# EasyEDA schematic SCH_555-Circuit_2024-04-25.json
TITLE: Sheet_1; REV: 1.0; Date: 2024-04-22; Sheet: 1/1; Drawn By: brianwes77; Company: Your Company
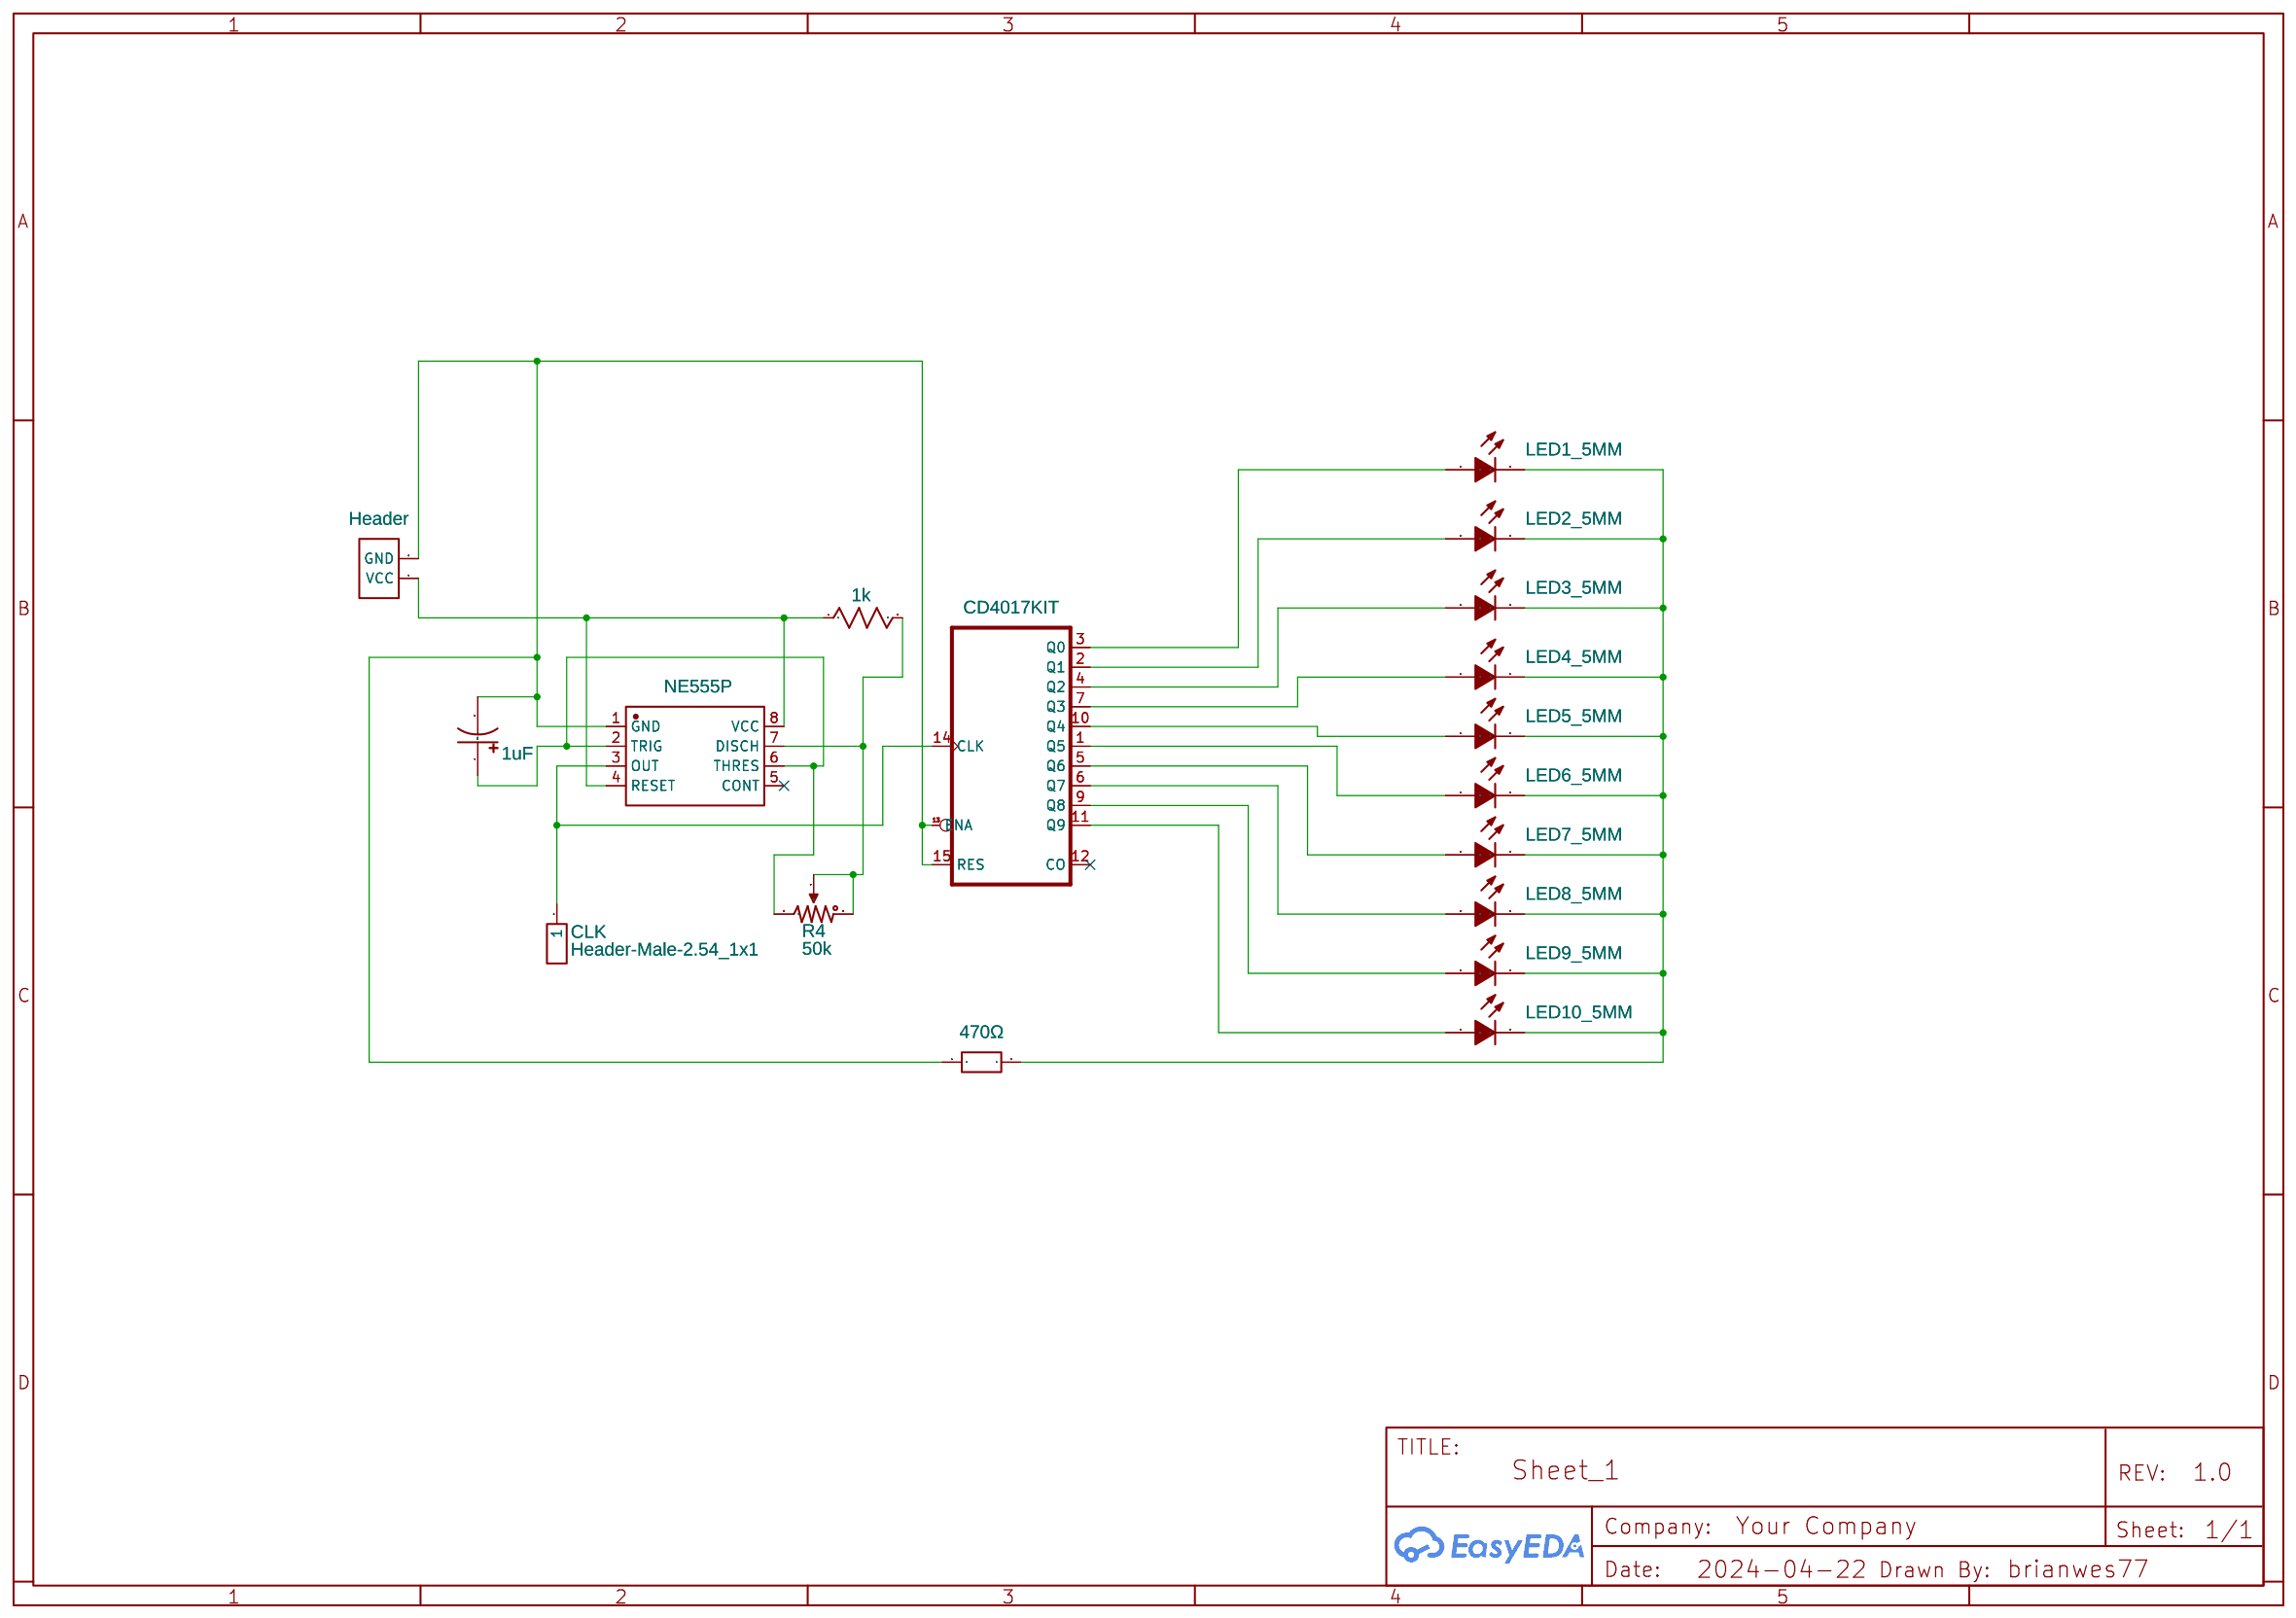
[diagram p0: schematic sheet]

## Parts
C1  1uF  [CAP-TH_BD5.0-P2.00-D0.8-FD]
CLK  Header-Male-2.54_1x1  [HDR-TH_1P-P2.54-V-M]
H1  Header  [HEADER-FEMALE-2.54_1X2]
LED1_5MM  LED_5MM  [LED-TH_BD5.0-P2.54-FD_C9900023552]
LED2_5MM  LED_5MM  [LED-TH_BD5.0-P2.54-FD_C9900023552]
LED3_5MM  LED_5MM  [LED-TH_BD5.0-P2.54-FD_C9900023552]
LED4_5MM  LED_5MM  [LED-TH_BD5.0-P2.54-FD_C9900023552]
LED5_5MM  LED_5MM  [LED-TH_BD5.0-P2.54-FD_C9900023552]
LED6_5MM  LED_5MM  [LED-TH_BD5.0-P2.54-FD_C9900023552]
LED7_5MM  LED_5MM  [LED-TH_BD5.0-P2.54-FD_C9900023552]
LED8_5MM  LED_5MM  [LED-TH_BD5.0-P2.54-FD_C9900023552]
LED9_5MM  LED_5MM  [LED-TH_BD5.0-P2.54-FD_C9900023552]
LED10_5MM  LED_5MM  [LED-TH_BD5.0-P2.54-FD_C9900023552]
R2  1k  [AXIAL-0.3]
R4  50k  [RES-ADJ_3296X]
U1  CD4017KIT  [DIL16-KIT]  (section 1)
U2  NE555P  [DIP-8_L9.8-W6.6-P2.54-LS7.6-BL]
U3  470Ω  [RES-TH_BD3.3-L9.0-P13.00-D0.6]

## Library data of the parts
C1 = UVZ1H010MDD: Contributor: LCSC; Supplier: LCSC; Supplier Part: C433277; Manufacturer: Nichicon(尼吉康)
CLK = Header-Male-2.54_1x1: Supplier: LCSC; Manufacturer: BOOMELE(博穆精密); Manufacturer Part: 2.54-1*1P针; Supplier Part: C81276; JLCPCB Part Class: Extended Part
H1 = HEADER-FEMALE-2.54_1X2: Contributor: nonstop2004; Supplier: LCSC; Supplier Part: C492401
LED1_5MM LED2_5MM LED3_5MM LED4_5MM LED5_5MM LED6_5MM LED7_5MM LED8_5MM LED9_5MM LED10_5MM = LED_5MM: Contributor: lcsc; Supplier: LCSC; Supplier Part: C2992663; Manufacturer: null; JLCPCB Part Class: Extended Part
R2 = Resistor: Manufacturer Part: ?; Supplier: LCSC; Supplier Part: C713997
R4 = Potentiometer: K(%): 50; Manufacturer Part: ?; Supplier: LCSC; Supplier Part: C118912
U1 = CD4017KIT: Contributor: SparkFun; subpart_no: 1; Supplier: LCSC; Supplier Part: C34519
U2 = NE555P: Supplier: LCSC; Manufacturer: TI(德州仪器); Supplier Part: C46749; JLCPCB Part Class: Extended Part
U3 = RSF-50JT-52-470R: Contributor: lcsc; Supplier: LCSC; Supplier Part: C58592; Manufacturer: YAGEO(国巨)

## Nets
Net-(C1-1): C1.1 R4.1 U2.2(TRIG) U2.6(THRES)
Net-(C1-2): C1.2 H1.2(GND) U1.13(ENA) U1.15(RES) U2.1(GND) U3.1
Net-(CLK-1): CLK.1 U1.14(CLK) U2.3(OUT)
Net-(H1-1): H1.1(VCC) R2.1 U2.4(RESET) U2.8(VCC)
Net-(LED1_5MM-1): LED1_5MM.1(A) U1.3(Q0)
Net-(LED1_5MM-2): LED1_5MM.2(K) LED2_5MM.2(K) LED3_5MM.2(K) LED4_5MM.2(K) LED5_5MM.2(K) LED6_5MM.2(K) LED7_5MM.2(K) LED8_5MM.2(K) LED9_5MM.2(K) LED10_5MM.2(K) U3.2
Net-(LED2_5MM-1): LED2_5MM.1(A) U1.2(Q1)
Net-(LED3_5MM-1): LED3_5MM.1(A) U1.4(Q2)
Net-(LED4_5MM-1): LED4_5MM.1(A) U1.7(Q3)
Net-(LED5_5MM-1): LED5_5MM.1(A) U1.10(Q4)
Net-(LED6_5MM-1): LED6_5MM.1(A) U1.1(Q5)
Net-(LED7_5MM-1): LED7_5MM.1(A) U1.5(Q6)
Net-(LED8_5MM-1): LED8_5MM.1(A) U1.6(Q7)
Net-(LED9_5MM-1): LED9_5MM.1(A) U1.9(Q8)
Net-(LED10_5MM-1): LED10_5MM.1(A) U1.11(Q9)
Net-(R2-2): R2.2 R4.2(3) R4.3(2) U2.7(DISCH)

Not connected (* = marked no-connect by the designer): U1 12(CO)*; U2 5(CONT)*
